# Altium schematic sheet RK3562-VCCIO5.SchDoc
size 420 x 297 mm; SheetNumber: 10; SheetTotal: 32
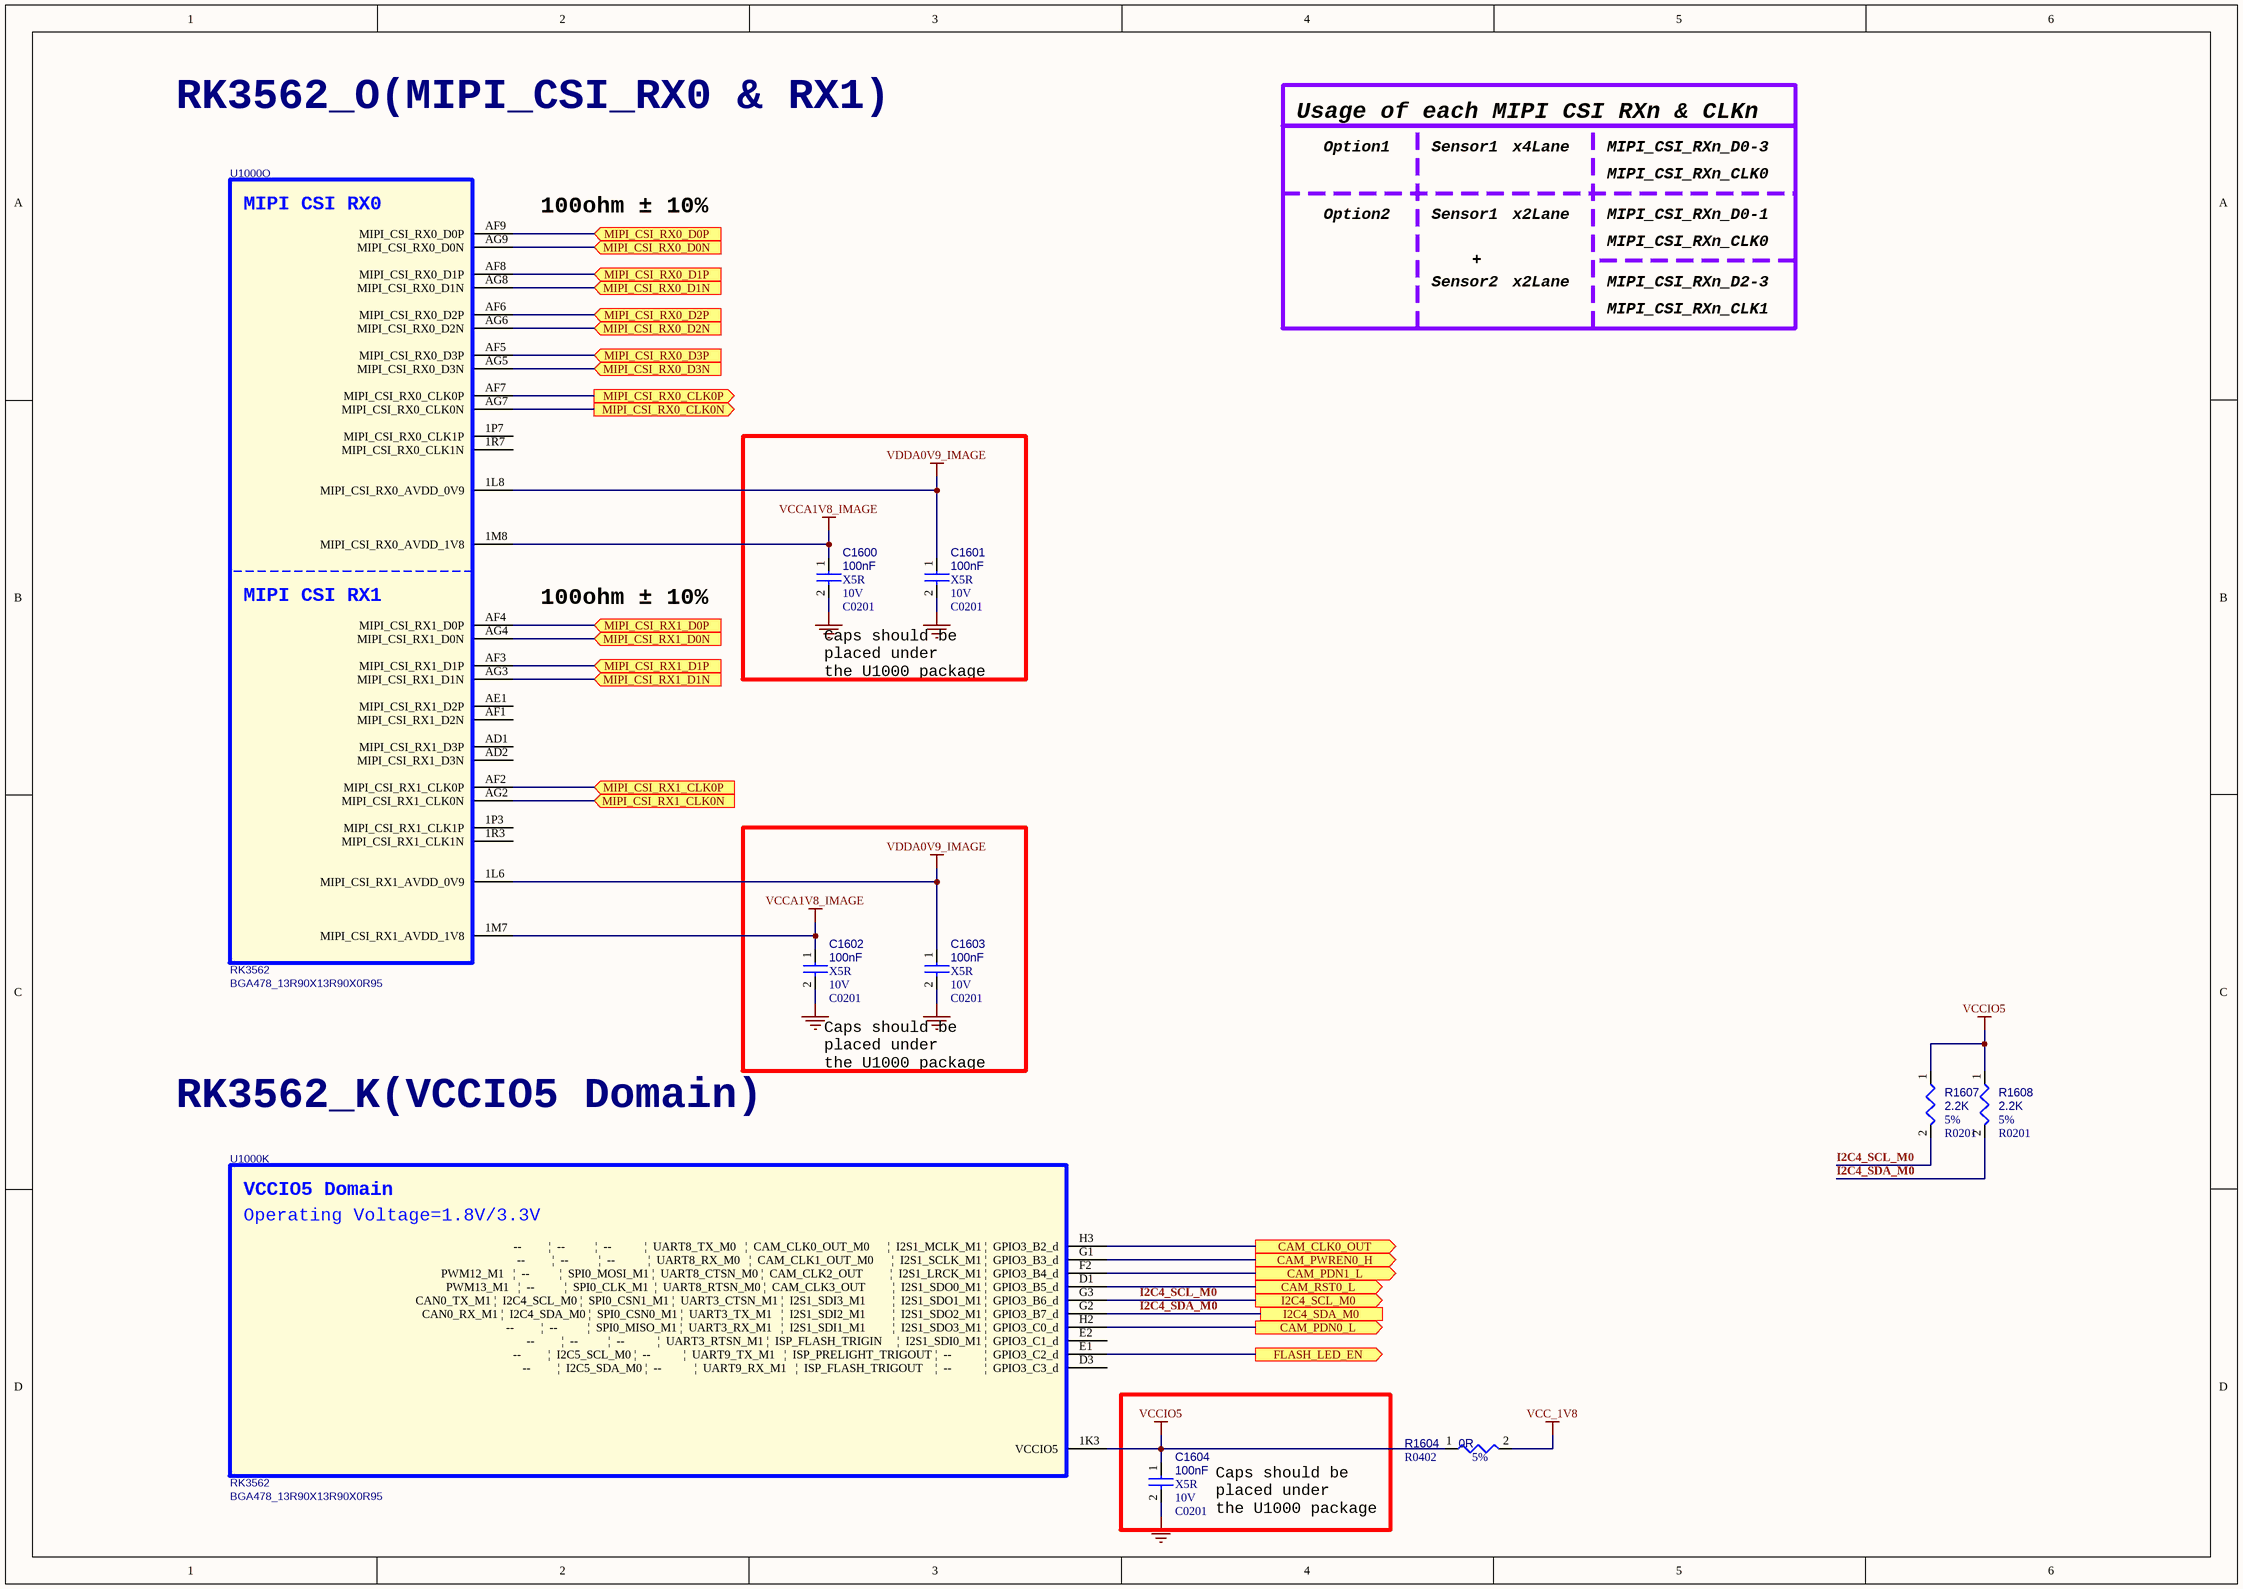
[diagram p0: RK3562-VCCIO5.SchDoc]

## Parts
C1600  100nF  Dielectric: X5R  Voltage: 10V  [C0201]
C1601  100nF  Dielectric: X5R  Voltage: 10V  [C0201]
C1602  100nF  Dielectric: X5R  Voltage: 10V  [C0201]
C1603  100nF  Dielectric: X5R  Voltage: 10V  [C0201]
C1604  100nF  Dielectric: X5R  Voltage: 10V  [C0201]
R1604  0R  Tolerance: 5%  [R0402]
R1607  2.2K  Tolerance: 5%  [R0201]
R1608  2.2K  Tolerance: 5%  [R0201]
U1000  RK3562  [BGA478_13R90X13R90X0R95]  (parts K,O of 16)

## Ports
CAM_CLK0_OUT (out, see CONTROLLER-RK3562[4C], CONTROLLER-RK3562[3C], MIPI-CAMERA[1B]), CAM_PDN0_L (out, see CONTROLLER-RK3562[4C], CONTROLLER-RK3562[3C], MIPI-CAMERA[1C]), CAM_PDN1_L (out, see CONTROLLER-RK3562[4C]), CAM_PWREN0_H (out, see CONTROLLER-RK3562[4C]), CAM_RST0_L (out, see CONTROLLER-RK3562[4C], CONTROLLER-RK3562[3C], MIPI-CAMERA[1B]), FLASH_LED_EN (out, see CONTROLLER-RK3562[4C]), I2C4_SCL_M0 (out, see CONTROLLER-RK3562[4C], CONTROLLER-RK3562[3C], MIPI-CAMERA[1B]), I2C4_SDA_M0 (see CONTROLLER-RK3562[4C], CONTROLLER-RK3562[3C], MIPI-CAMERA[1B]), MIPI_CSI_RX0_CLK0N (out, see CONTROLLER-RK3562[4C], CONTROLLER-RK3562[3C], MIPI-CAMERA[1B]), MIPI_CSI_RX0_CLK0P (out, see CONTROLLER-RK3562[4C], CONTROLLER-RK3562[3C], MIPI-CAMERA[1B]), MIPI_CSI_RX0_D0N (in, see CONTROLLER-RK3562[4B], CONTROLLER-RK3562[3B], MIPI-CAMERA[1B]), MIPI_CSI_RX0_D0P (in, see CONTROLLER-RK3562[4B], CONTROLLER-RK3562[3B], MIPI-CAMERA[1B]), MIPI_CSI_RX0_D1N (in, see CONTROLLER-RK3562[4C], CONTROLLER-RK3562[3C], MIPI-CAMERA[1B]), MIPI_CSI_RX0_D1P (in, see CONTROLLER-RK3562[4B], CONTROLLER-RK3562[3B], MIPI-CAMERA[1B]), MIPI_CSI_RX0_D2N (in, see CONTROLLER-RK3562[4C], CONTROLLER-RK3562[3C], MIPI-CAMERA[1B]), MIPI_CSI_RX0_D2P (in, see CONTROLLER-RK3562[4C], CONTROLLER-RK3562[3C], MIPI-CAMERA[1B]), MIPI_CSI_RX0_D3N (in, see CONTROLLER-RK3562[4C], CONTROLLER-RK3562[3C], MIPI-CAMERA[1B]), MIPI_CSI_RX0_D3P (in, see CONTROLLER-RK3562[4C], CONTROLLER-RK3562[3C], MIPI-CAMERA[1B]), MIPI_CSI_RX1_CLK0N (in, see CONTROLLER-RK3562[4C]), MIPI_CSI_RX1_CLK0P (in, see CONTROLLER-RK3562[4C]), MIPI_CSI_RX1_D0N (in, see CONTROLLER-RK3562[4C]), MIPI_CSI_RX1_D0P (in, see CONTROLLER-RK3562[4C]), MIPI_CSI_RX1_D1N (in, see CONTROLLER-RK3562[4C]), MIPI_CSI_RX1_D1P (in, see CONTROLLER-RK3562[4C])

## Nets
GND: C1600.2 C1601.2 C1602.2 C1603.2 C1604.2
VCC_1V8: R1604.2
VCCA1V8_IMAGE: C1600.1 C1602.1 U1000.1M7(MIPI_CSI_RX1_AVDD_1V8) U1000.1M8(MIPI_CSI_RX0_AVDD_1V8)
VCCIO5: C1604.1 R1604.1 R1607.1 R1608.1 U1000.1K3(VCCIO5)
VDDA0V9_IMAGE: C1601.1 C1603.1 U1000.1L6(MIPI_CSI_RX1_AVDD_0V9) U1000.1L8(MIPI_CSI_RX0_AVDD_0V9)
CAM_CLK0_OUT: U1000.H3(--_________|__--__________|__--___________|__UART8_TX_M0___|__CAM_CLK0_OUT_M0______|__I2S1_MCLK_M1_|__GPIO3_B2_d) ; port CAM_CLK0_OUT
CAM_PDN0_L: U1000.H2(--_________|__--__________|__SPI0_MISO_M1_|__UART3_RX_M1___|__I2S1_SDI1_M1_________|__I2S1_SDO3_M1_|__GPIO3_C0_d) ; port CAM_PDN0_L
CAM_PDN1_L: U1000.F2(PWM12_M1___|__--__________|__SPI0_MOSI_M1_|__UART8_CTSN_M0_|__CAM_CLK2_OUT_________|__I2S1_LRCK_M1_|__GPIO3_B4_d) ; port CAM_PDN1_L
CAM_PWREN0_H: U1000.G1(--_________|__--__________|__--___________|__UART8_RX_M0___|__CAM_CLK1_OUT_M0______|__I2S1_SCLK_M1_|__GPIO3_B3_d) ; port CAM_PWREN0_H
CAM_RST0_L: U1000.D1(PWM13_M1___|__--__________|__SPI0_CLK_M1__|__UART8_RTSN_M0_|__CAM_CLK3_OUT_________|__I2S1_SDO0_M1_|__GPIO3_B5_d) ; port CAM_RST0_L
FLASH_LED_EN: U1000.E1(--_________|__I2C5_SCL_M0_|__--___________|__UART9_TX_M1___|__ISP_PRELIGHT_TRIGOUT_|__--___________|__GPIO3_C2_d) ; port FLASH_LED_EN
I2C4_SCL_M0: R1607.2 U1000.G3(CAN0_TX_M1_|__I2C4_SCL_M0_|__SPI0_CSN1_M1_|__UART3_CTSN_M1_|__I2S1_SDI3_M1_________|__I2S1_SDO1_M1_|__GPIO3_B6_d) ; port I2C4_SCL_M0
I2C4_SDA_M0: R1608.2 U1000.G2(CAN0_RX_M1_|__I2C4_SDA_M0_|__SPI0_CSN0_M1_|__UART3_TX_M1___|__I2S1_SDI2_M1_________|__I2S1_SDO2_M1_|__GPIO3_B7_d) ; port I2C4_SDA_M0
MIPI_CSI_RX0_CLK0N: U1000.AG7(MIPI_CSI_RX0_CLK0N) ; port MIPI_CSI_RX0_CLK0N
MIPI_CSI_RX0_CLK0P: U1000.AF7(MIPI_CSI_RX0_CLK0P) ; port MIPI_CSI_RX0_CLK0P
MIPI_CSI_RX0_D0N: U1000.AG9(MIPI_CSI_RX0_D0N) ; port MIPI_CSI_RX0_D0N
MIPI_CSI_RX0_D0P: U1000.AF9(MIPI_CSI_RX0_D0P) ; port MIPI_CSI_RX0_D0P
MIPI_CSI_RX0_D1N: U1000.AG8(MIPI_CSI_RX0_D1N) ; port MIPI_CSI_RX0_D1N
MIPI_CSI_RX0_D1P: U1000.AF8(MIPI_CSI_RX0_D1P) ; port MIPI_CSI_RX0_D1P
MIPI_CSI_RX0_D2N: U1000.AG6(MIPI_CSI_RX0_D2N) ; port MIPI_CSI_RX0_D2N
MIPI_CSI_RX0_D2P: U1000.AF6(MIPI_CSI_RX0_D2P) ; port MIPI_CSI_RX0_D2P
MIPI_CSI_RX0_D3N: U1000.AG5(MIPI_CSI_RX0_D3N) ; port MIPI_CSI_RX0_D3N
MIPI_CSI_RX0_D3P: U1000.AF5(MIPI_CSI_RX0_D3P) ; port MIPI_CSI_RX0_D3P
MIPI_CSI_RX1_CLK0N: U1000.AG2(MIPI_CSI_RX1_CLK0N) ; port MIPI_CSI_RX1_CLK0N
MIPI_CSI_RX1_CLK0P: U1000.AF2(MIPI_CSI_RX1_CLK0P) ; port MIPI_CSI_RX1_CLK0P
MIPI_CSI_RX1_D0N: U1000.AG4(MIPI_CSI_RX1_D0N) ; port MIPI_CSI_RX1_D0N
MIPI_CSI_RX1_D0P: U1000.AF4(MIPI_CSI_RX1_D0P) ; port MIPI_CSI_RX1_D0P
MIPI_CSI_RX1_D1N: U1000.AG3(MIPI_CSI_RX1_D1N) ; port MIPI_CSI_RX1_D1N
MIPI_CSI_RX1_D1P: U1000.AF3(MIPI_CSI_RX1_D1P) ; port MIPI_CSI_RX1_D1P

Not connected (* = marked no-connect by the designer): U1000 1P3(MIPI_CSI_RX1_CLK1P) 1P7(MIPI_CSI_RX0_CLK1P) 1R3(MIPI_CSI_RX1_CLK1N) 1R7(MIPI_CSI_RX0_CLK1N) AD1(MIPI_CSI_RX1_D3P) AD2(MIPI_CSI_RX1_D3N) AE1(MIPI_CSI_RX1_D2P) AF1(MIPI_CSI_RX1_D2N) D3(--_________|__I2C5_SDA_M0_|__--___________|__UART9_RX_M1___|__ISP_FLASH_TRIGOUT____|__--___________|__GPIO3_C3_d) E2(--_________|__--__________|__--___________|__UART3_RTSN_M1_|__ISP_FLASH_TRIGIN_____|__I2S1_SDI0_M1_|__GPIO3_C1_d)

## Notes on the sheet
- RK3562_O(MIPI_CSI_RX0 & RX1)
- Usage of each MIPI CSI RXn & CLKn
- Option1
- Sensor1
- x4Lane
- MIPI_CSI_RXn_D0-3
- MIPI_CSI_RXn_CLK0
- 100ohm ± 10%
- Option2
- x2Lane
- MIPI_CSI_RXn_D0-1
- Sensor2
- +
- MIPI_CSI_RXn_D2-3
- MIPI_CSI_RXn_CLK1
- Caps should be
  placed under
  the U1000 package
- RK3562_K(VCCIO5 Domain)
- (in symbol SOC_RK3562, part K) VCCIO5 Domain; Operating Voltage=1.8V/3.3V
- (in symbol SOC_RK3562, part O) MIPI CSI RX0; MIPI CSI RX1

## Library data of the parts
C1600 = CAP NP: cap,100.00nF,+/-10%,10V,X5R,C0201; Part Reference: C1600; Manufacturer: TDK; RK PN: C0603X5R1A104K030BC; Priority: A; Tolerance: 10%; PCB Footprint: C0201; Value: 100nF; Part Type: C0201; Manufacturer PN: C0603X5R1A104K030BC; Created by: JJJ; ClassName: RK
C1601 = CAP NP: cap,100.00nF,+/-10%,10V,X5R,C0201; Part Reference: C1601; Manufacturer PN: C0603X5R1A104K030BC; Manufacturer: TDK; Tolerance: 10%; Priority: A; PCB Footprint: C0201; Value: 100nF; Created by: JJJ; Part Type: C0201; RK PN: C0603X5R1A104K030BC; ClassName: RK
C1602 = CAP NP: cap,100.00nF,+/-10%,10V,X5R,C0201; Part Reference: C1602; Manufacturer: TDK; RK PN: C0603X5R1A104K030BC; Priority: A; Tolerance: 10%; PCB Footprint: C0201; Value: 100nF; Part Type: C0201; Manufacturer PN: C0603X5R1A104K030BC; Created by: JJJ; ClassName: RK
C1603 = CAP NP: cap,100.00nF,+/-10%,10V,X5R,C0201; Part Reference: C1603; Manufacturer PN: C0603X5R1A104K030BC; Manufacturer: TDK; Tolerance: 10%; Priority: A; PCB Footprint: C0201; Value: 100nF; Created by: JJJ; Part Type: C0201; RK PN: C0603X5R1A104K030BC; ClassName: RK
C1604 = CAP NP: cap,100.00nF,+/-10%,10V,X5R,C0201; Part Reference: C1604; Manufacturer: TDK; RK PN: C0603X5R1A104K030BC; Priority: A; Tolerance: 10%; PCB Footprint: C0201; Value: 100nF; Part Type: C0201; Manufacturer PN: C0603X5R1A104K030BC; Created by: JJJ; ClassName: RK
R1604 = RESISTOR: 通用厚膜电阻,0R,+/-5%,R0402,1/16W.; Part Reference: R1604; Manufacturer PN: RC0402JR-070RL; Manufacturer: YAGEO; Wattage: 1/16W; Priority: A; RK PN: 901001446; PCB Footprint: R0402; Value: 0R; Created by: YTL; Part Type: 通用厚膜电阻; ClassName: RK
R1607 = RESISTOR: 通用厚膜电阻,2K2,+/-5%,R0201,1/20W.; Part Reference: R1607; Manufacturer: YAGEO; Manufacturer PN: RC0201JR-072K2L; RK PN: 901000532; Priority: A; Wattage: 1/20W; PCB Footprint: R0201; Value: 2.2K; Part Type: 通用厚膜电阻; Created by: YTL; ClassName: RK
R1608 = RESISTOR: 通用厚膜电阻,2K2,+/-5%,R0201,1/20W.; Part Reference: R1608; Manufacturer PN: RC0201JR-072K2L; Manufacturer: YAGEO; Wattage: 1/20W; Priority: A; RK PN: 901000532; PCB Footprint: R0201; Value: 2.2K; Created by: YTL; Part Type: 通用厚膜电阻; ClassName: RK
U1000 = SOC_RK3562: ROCKCHIP SOC; Part Reference: U1000; Manufacturer: Rockchip (瑞芯微); SPLIT_INST: TRUE; SWAP_INFO: (S1+S2+S3+S4+S5+S6+S7+S8+S9+S10+S11+S12+S13+S14+S15+S16); Priority: A; RK PN: 906000425; PCB Footprint: BGA478_13R90X13R90X0R95; Value: RK3562; Created by: JJJ; Manufacturer PN: RK3562; Part Type: SOC; ClassName: RK